# EAGLE design mcp73831_bo (EAGLE 6.2)
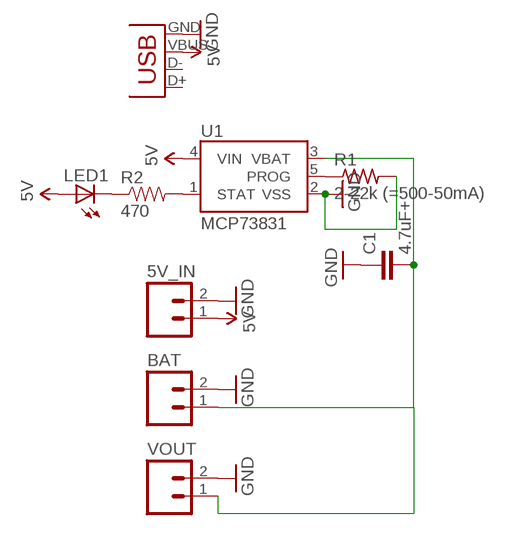
[diagram p0: schematic, sheet 1]

## Parts
5V_IN  M02PTH  [1X02]
BAT  M02PTH  [1X02]
C1  4.7uF+  C-EUC0805  [C0805]
LED1  LED0603  [LED-0603]
R1  2-22k (=500-50mA)  R-US_M0805  [M0805]
R2  470  RESISTOR0603-RES  [0603-RES]
U1  MCP73831  [SOT23-5]
VOUT  M02PTH  [1X02]
X1  USBSMD  [USB-MINIB]

## Nets
5V: 5V_IN.1 LED1.A U1.4(VIN) X1.VBUS
GND: 5V_IN.2 BAT.2 C1.1 R1.2 U1.2(VSS) VOUT.2 X1.GND
N$4: R2.2 U1.1(STAT)
N$5: LED1.C R2.1
PROG: R1.1 U1.5(PROG)
VBAT: BAT.1 C1.2 U1.3(VBAT) VOUT.1
Unconnected: X1.D+ X1.D-

## Library data of the parts
5V_IN BAT VOUT = SparkFun-Connectors:M02: Header 2 Standard 2-pin 0.1" header. Use with straight break away headers (SKU : PRT-00116), right angle break away headers (PRT-00553), swiss pins (PRT-00743), machine pins (PRT-00117), and female headers (PRT-00115). Molex polarized connector foot print use with SKU : PRT-08233 with associated crimp pins and housings.
C1 = rcl:C-EU: CAPACITOR, European symbol
LED1 = SparkFun-LED:LED: LEDs Standard schematic elements and footprints for 5mm, 3mm, 1206, and 0603 sized LEDs. 5mm - Spark Fun Electronics SKU : COM-00529 (and others)
R1 = rcl:R-US_: RESISTOR, American symbol
R2 = SparkFun-Passives:RESISTOR: Resistor Basic schematic elements and footprints for 0603, 1206, and PTH resistors.
U1 = SparkFun-PowerIC:MCP73831: Miniature single cell, fully integrated Li-Ion, Li-polymer charge management controller http://ww1.microchip.com/downloads/en/DeviceDoc/21984a.pdf
X1 = SparkFun-Connectors:USB: USB Connectors USB-B-PTH is fully proven SKU : PRT-00139 USB-miniB is fully proven SKU : PRT-00587 USB-A-PCB is untested. USB-A-H is throughly reviewed, but untested. Spark Fun Electronics SKU : PRT-00437 USB-B-SMT is throughly reviewed, but untested. Needs silkscreen touching up. USB-A-S has not been used/tested USB-MB-H has not been used/tested

## Board
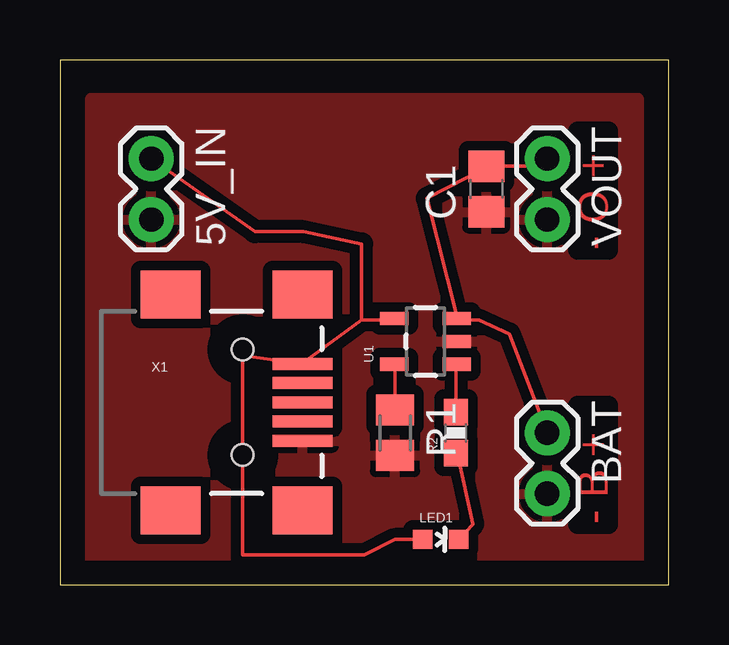
[diagram p1: board, top side]

Size 25.38 x 21.89 mm. Coordinates in mm from the lower left corner, seen from the top.
Outline: 0,0 25.38,0 25.38,21.89 0,21.89 0,0
Copper layers 1: Top 0.035mm
Design rules: minimum track width 6mil, minimum drill 24mil, track to track 8mil, track to pad 8mil, pad to pad 8mil, via to via 8mil, smd to smd 8mil, copper to edge 40mil, drill to drill 8mil, minimum pad ring 10mil, minimum via ring 8mil, stop-mask expansion 4mil, vias tented up to drill 0mil, thermal gap 10mil

### Footprints (pad centres in the part's own frame; a part is rotated, then mirrored left to right if it is on the bottom)
1X02 = drill 1.016 pad 1.88: 1 0,0; 2 2.54,0
C0805 = smd 1.3 x 1.5: 1 -0.95,0; 2 0.95,0
LED-0603 = smd 0.8 x 0.8: A 0,-0.75; C 0,0.75
M0805 = smd 1.3 x 1.6: 1 -0.95,0; 2 0.95,0
0603-RES = smd 1.1 x 1: 1 -0.85,0; 2 0.85,0
SOT23-5 = smd 0.55 x 1.2: 1 -0.95,-1.3; 2 0,-1.3; 3 0.95,-1.3; 4 0.95,1.3; 5 -0.95,1.3
USB-MINIB = smd 2.5 x 0.5: D+ 2.5,0; D- 2.5,0.8; GND 2.5,-1.6; ID 2.5,-0.8; VBUS 2.5,1.6 | smd 2.5 x 2: MTN1 -3,4.5; MTN2 2.5,4.5; MTN3 -3,-4.5; MTN4 2.5,-4.5 | hole 0.9: 0,2.2; 0,-2.2

### Placement (x,y rotation side)
5V_IN  3.81,17.78 270 top
BAT  20.32,6.35 270 top
C1  17.78,16.51 90 top
LED1  15.88,1.91 270 top
R1  13.97,6.35 270 top
R2  16.51,6.35 90 top
U1  15.24,10.16 90 top
VOUT  20.32,17.78 270 top
X1  7.62,7.62 0 top

### Tracks (layer width: path | path; a pad name or v marks a point on that pad's centre or on a via)
5V
  Top 0.152: 12.57,11.05 10.16,9.27 X1.VBUS 7.91,9.53 7.62,9.53 7.62,1.27 12.7,1.27 13.97,1.91 LED1.A | 12.57,11.05 13.91,11.05 U1.4 | 5V_IN.1 8.13,14.73 10.16,14.73 12.57,14.22 12.57,11.05
GND
  pour Top (isolate 0.406): 1.27,20.32 24.13,20.32 24.13,0 1.27,0
N$4
  Top 0.152: R2.2 16.51,9.21 U1.1
N$5
  Top 0.152: LED1.C 17.21,2.54 16.57,5.46 16.51,5.46 R2.1
PROG
  Top 0.152: R1.1 13.97,9.21 U1.5
VBAT
  Top 0.152: BAT.1 18.73,10.48 17.46,11.05 16.57,11.05 U1.3 16.57,11.11 15.3,16.13 17.78,17.4 C1.2 17.84,17.46 20,17.46 VOUT.1

### Text on the board
Top: - O + | - B +